# Altium schematic sheet Cube_Conector.SchDoc
size A2
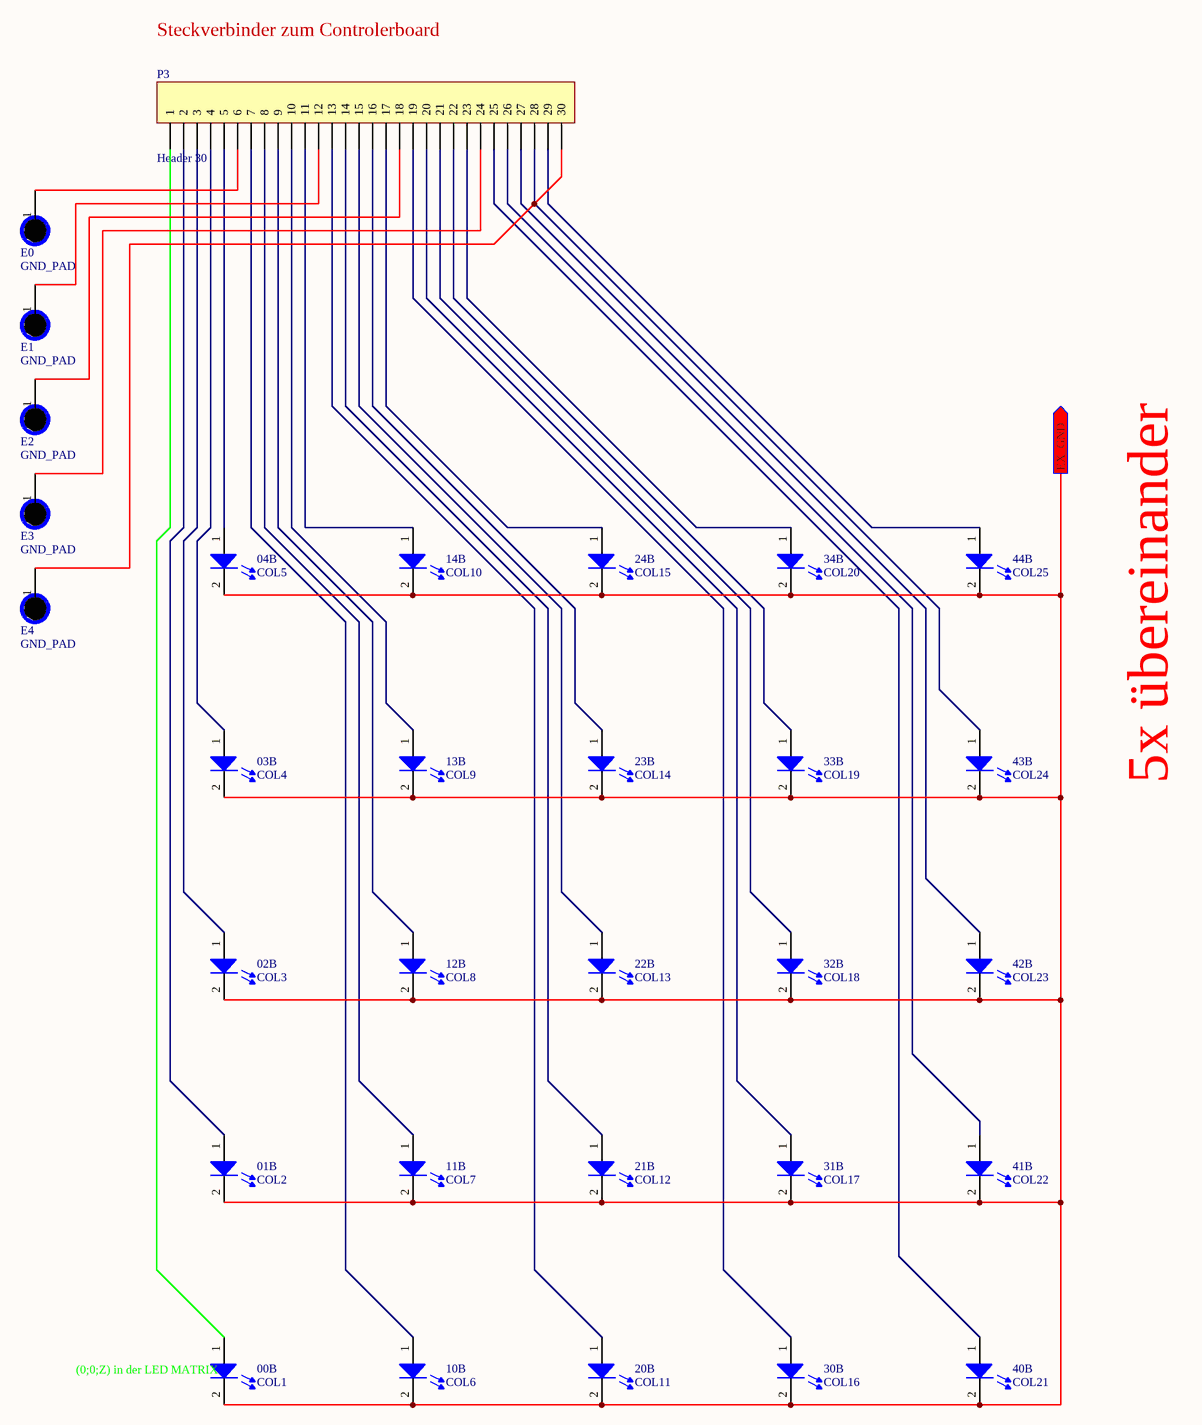
[diagram p0: Cube_Conector.SchDoc]

## Parts
00  COL1  [LED 3mm]  (part B of 2)
01  COL2  [LED 3mm]  (part B of 2)
02  COL3  [LED 3mm]  (part B of 2)
03  COL4  [LED 3mm]  (part B of 2)
04  COL5  [LED 3mm]  (part B of 2)
10  COL6  [LED 3mm]  (part B of 2)
11  COL7  [LED 3mm]  (part B of 2)
12  COL8  [LED 3mm]  (part B of 2)
13  COL9  [LED 3mm]  (part B of 2)
14  COL10  [LED 3mm]  (part B of 2)
20  COL11  [LED 3mm]  (part B of 2)
21  COL12  [LED 3mm]  (part B of 2)
22  COL13  [LED 3mm]  (part B of 2)
23  COL14  [LED 3mm]  (part B of 2)
24  COL15  [LED 3mm]  (part B of 2)
30  COL16  [LED 3mm]  (part B of 2)
31  COL17  [LED 3mm]  (part B of 2)
32  COL18  [LED 3mm]  (part B of 2)
33  COL19  [LED 3mm]  (part B of 2)
34  COL20  [LED 3mm]  (part B of 2)
40  COL21  [LED 3mm]  (part B of 2)
41  COL22  [LED 3mm]  (part B of 2)
42  COL23  [LED 3mm]  (part B of 2)
43  COL24  [LED 3mm]  (part B of 2)
44  COL25  [LED 3mm]  (part B of 2)
E0  GND_PAD  [GND_PAD]
E1  GND_PAD  [GND_PAD]
E2  GND_PAD  [GND_PAD]
E3  GND_PAD  [GND_PAD]
E4  GND_PAD  [GND_PAD]
P3  Header 30  [HDR1X30]

## Ports
EX_GND (out)

## Nets
EX_GND: 00.2 01.2 02.2 03.2 04.2 10.2 11.2 12.2 13.2 14.2 20.2 21.2 22.2 23.2 24.2 30.2 31.2 32.2 33.2 34.2 40.2 41.2 42.2 43.2 44.2 ; port EX_GND
Net00_1: 00.1 P3.1
Net01_1: 01.1 P3.2
Net02_1: 02.1 P3.3
Net03_1: 03.1 P3.4
Net04_1: 04.1 P3.5
Net10_1: 10.1 P3.7
Net11_1: 11.1 P3.8
Net12_1: 12.1 P3.9
Net13_1: 13.1 P3.10
Net14_1: 14.1 P3.11
Net20_1: 20.1 P3.13
Net21_1: 21.1 P3.14
Net22_1: 22.1 P3.15
Net23_1: 23.1 P3.16
Net24_1: 24.1 P3.17
Net30_1: 30.1 P3.19
Net31_1: 31.1 P3.20
Net32_1: 32.1 P3.21
Net33_1: 33.1 P3.22
Net34_1: 34.1 P3.23
Net40_1: 40.1 P3.25
Net41_1: 41.1 P3.26
Net42_1: 42.1 P3.27
Net43_1: 43.1 E4.1(GND) P3.28 P3.30
Net44_1: 44.1 P3.29
NetE0_1: E0.1(GND) P3.6
NetE1_1: E1.1(GND) P3.12
NetE2_1: E2.1(GND) P3.18
NetE3_1: E3.1(GND) P3.24

## Notes on the sheet
- Steckverbinder zum Controlerboard
- 5x übereinander
- (near 00) (0;0;Z) in der LED MATRIX

## Library data of the parts
00 01 02 03 04 10-14 20-24 30-34 40-44 = LED Std: LED bedrahtet
P3 = Header 30: Header, 30-Pin; LatestRevisionDate: 17-Jul-2002; LatestRevisionNote: Re-released for DXP Platform.; Publisher: Altium Limited